# Altium schematic sheet SD_Card.SchDoc: Audio Research: SD Card
size A4; DrawnBy: Connor Dack; Engineer: Connor Dack; DocumentNumber: 9; Revision: 1.0; SheetNumber: 9; SheetTotal: 20
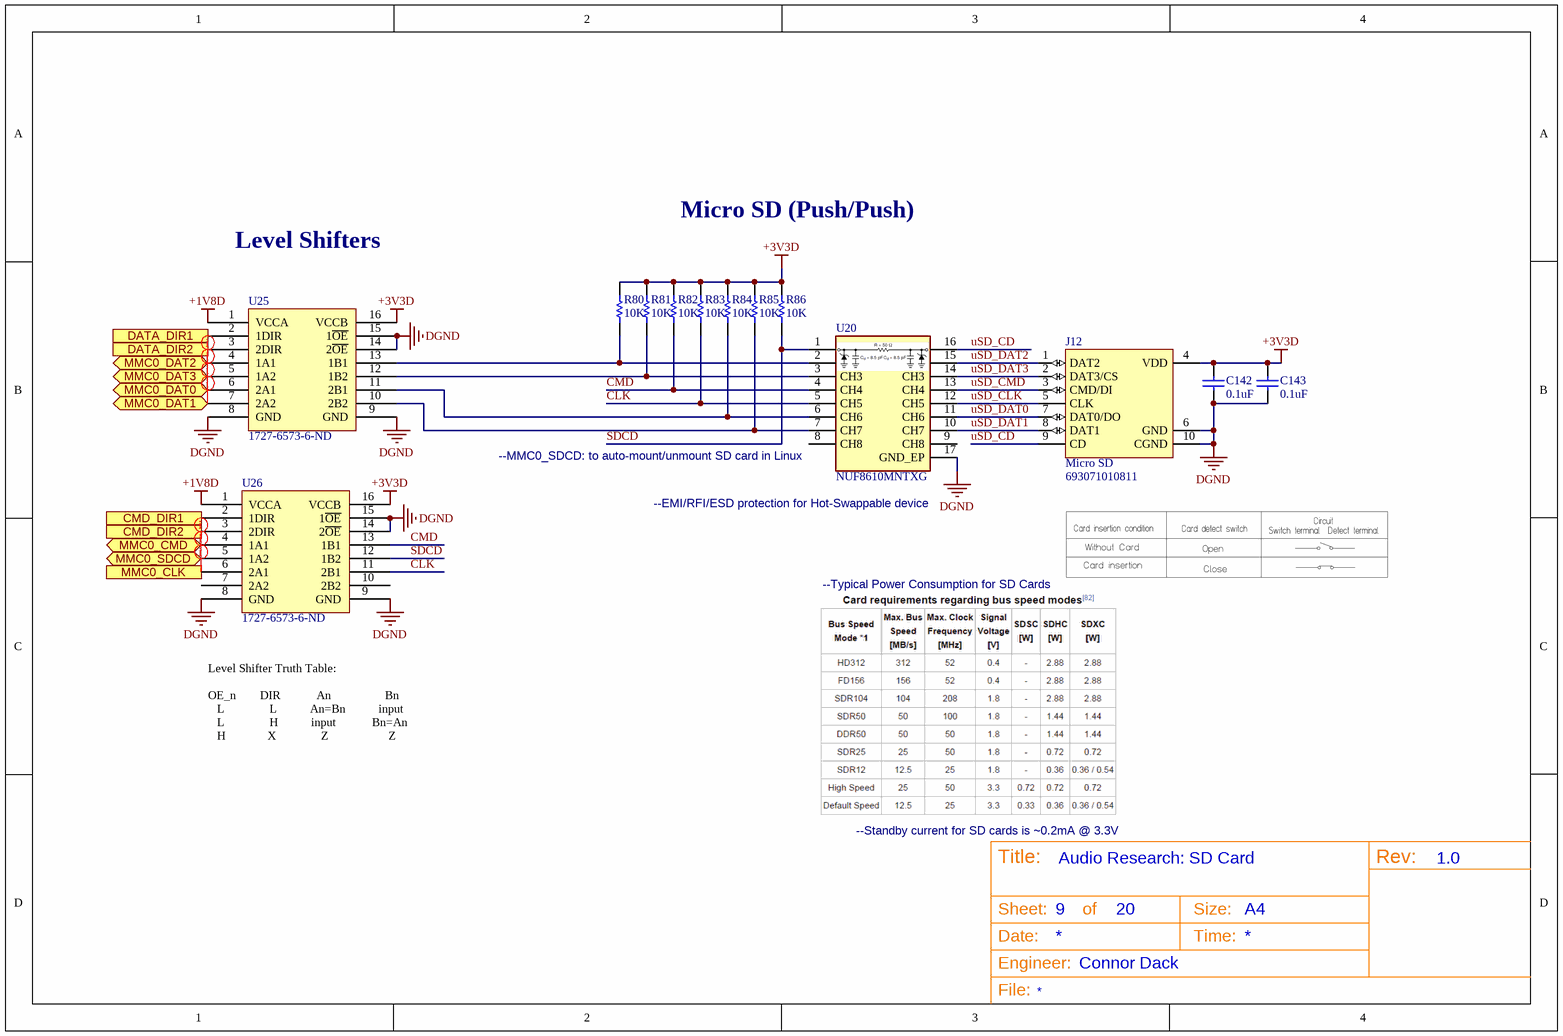
[diagram p0: SD_Card.SchDoc]

## Parts
C142  Capacitance: 0.1uF  [3-0603_L]  (hidden comment: CL10F104ZO8NNNC)
C143  Capacitance: 0.1uF  [3-0603_L]  (hidden comment: CL10F104ZO8NNNC)
J12  Micro SD  [693071010811]
R80  Resistance (Ohms): 10K  [2-0402_R_L]  (hidden comment: ERJ-2GEJ103X)
R81  Resistance (Ohms): 10K  [2-0402_R_L]  (hidden comment: ERJ-2GEJ103X)
R82  Resistance (Ohms): 10K  [2-0402_R_L]  (hidden comment: ERJ-2GEJ103X)
R83  Resistance (Ohms): 10K  [2-0402_R_L]  (hidden comment: ERJ-2GEJ103X)
R84  Resistance (Ohms): 10K  [2-0402_R_L]  (hidden comment: ERJ-2GEJ103X)
R85  Resistance (Ohms): 10K  [2-0402_R_L]  (hidden comment: ERJ-2GEJ103X)
R86  Resistance (Ohms): 10K  [2-0402_R_L]  (hidden comment: ERJ-2GEJ103X)
U20  NUF8610MNTXG  [ONSC-DFN-16-506AC_V]
U25  Supplier Part Number 1: 1727-6573-6-ND  [TSOP65P640X120-16N]  (hidden comment: IC TXRX 4BIT DUAL 3ST 16TSSOP)
U26  Supplier Part Number 1: 1727-6573-6-ND  [TSOP65P640X120-16N]  (hidden comment: IC TXRX 4BIT DUAL 3ST 16TSSOP)

## Ports
CMD_DIR1 (in), CMD_DIR2 (in), DATA_DIR1 (in), DATA_DIR2 (in), MMC0_CLK (in), MMC0_CMD (bidir), MMC0_DAT0 (bidir), MMC0_DAT1 (bidir), MMC0_DAT2 (bidir), MMC0_DAT3 (bidir), MMC0_SDCD (bidir)

## Nets
+1V8D: U25.1(VCCA) U26.1(VCCA)
+3V3D: C142.1 C143.1 J12.4(VDD) R80.2 R81.2 R82.2 R83.2 R84.2 R85.2 R86.2 U25.16(VCCB) U26.16(VCCB)
DGND: C142.2 C143.2 J12.6(GND) J12.10(CGND) U20.17(GND_EP) U25.8(GND) U25.9(GND) U25.14(2~{OE}) U25.15(1~{OE}) U26.8(GND) U26.9(GND) U26.14(2~{OE}) U26.15(1~{OE})
CLK: R83.1 U20.5(CH5) U26.11(2B1)
CMD: R82.1 U20.4(CH4) U26.13(1B1)
CMD_DIR1: U26.2(1DIR) ; port CMD_DIR1
CMD_DIR2: U26.3(2DIR) ; port CMD_DIR2
DATA_DIR1: U25.2(1DIR) ; port DATA_DIR1
DATA_DIR2: U25.3(2DIR) ; port DATA_DIR2
MMC0_CLK: U26.6(2A1) ; port MMC0_CLK
MMC0_CMD: U26.4(1A1) ; port MMC0_CMD
MMC0_DAT0: U25.6(2A1) ; port MMC0_DAT0
MMC0_DAT1: U25.7(2A2) ; port MMC0_DAT1
MMC0_DAT2: U25.4(1A1) ; port MMC0_DAT2
MMC0_DAT3: U25.5(1A2) ; port MMC0_DAT3
MMC0_SDCD: U26.5(1A2) ; port MMC0_SDCD
SDCD: R86.1 U20.1(CH1) U26.12(1B2)
uSD_CD: J12.9(CD) U20.16(CH1)
uSD_CLK: J12.5(CLK) U20.12(CH5)
uSD_CMD: J12.3(CMD/DI) U20.13(CH4)
uSD_DAT0: J12.7(DAT0/DO) U20.11(CH6)
uSD_DAT1: J12.8(DAT1) U20.10(CH7)
uSD_DAT2: J12.1(DAT2) U20.15(CH2)
uSD_DAT3: J12.2(DAT3/CS) U20.14(CH3)
NetR80_1: R80.1 U20.2(CH2) U25.13(1B1)
NetR81_1: R81.1 U20.3(CH3) U25.12(1B2)
NetR84_1: R84.1 U20.6(CH6) U25.11(2B1)
NetR85_1: R85.1 U20.7(CH7) U25.10(2B2)

Not connected (* = marked no-connect by the designer): U20 8(CH8) 9(CH8); U26 7(2A2) 10(2B2)

## Layout directives
net class SD_CARD: MMC0_CLK, MMC0_CMD, MMC0_DAT0, MMC0_DAT1, MMC0_DAT2, MMC0_DAT3, MMC0_SDCD

## Notes on the sheet
- Level Shifters
- Micro SD (Push/Push)
- (near U20) --MMC0_SDCD: to auto-mount/unmount SD card in Linux
- (near U20) --EMI/RFI/ESD protection for Hot-Swappable device
- --Typical Power Consumption for SD Cards
- Level Shifter Truth Table:
  OE_n        DIR            An                  Bn
  L               L           An=Bn           input
  L               H           input            Bn=An
  H              X               Z                    Z
- --Standby current for SD cards is ~0.2mA @ 3.3V
- Title:
- Sheet:
- of
- Size:
- A4
- Rev:
- Date:
- Engineer:
- Time:
- File:

## Library data of the parts
C142 C143 = CL10F104ZO8NNNC: CAP CER 0.1UF 16V Y5V 0603; Manufacturer: Samsung; Tolerance: 80%; Supplier 1: Digi-Key; Stock 1: 40000; Pricing 1: 1=0.1, 10=0.038, 100=0.0169, 500=0.01208, 1000=0.00949 (USD); Mount: Surface Mount; Case/Package: 0603; Case Code (Metric): 1608; Case Code (Imperial): 0603; Min Operating Temperature: -30°C; Max Operating Temperature: 85°C; Package Quantity: 1; Packaging: Tape and Reel; Voltage Rating: 16V; Dielectric: Y5V; Length: 1.6mm; Height: 0.8mm; Width: 0.031inch; Thickness: 0.035inch; Depth: 0.8mm; Radiation Hardening: No; ComponentLink1URL: https://datasheet.ciiva.com/25805/cl10f104zo8nnnc-25805810.pdf; ComponentLink1Description: https://datasheet.ciiva.com/25805/cl10f104zo8nnnc-25805810.pdf; ComponentLink2URL: https://datasheet.ciiva.com/16199/cl10f104zo8nnnc-16199254.pdf; ComponentLink2Description: https://datasheet.ciiva.com/16199/cl10f104zo8nnnc-16199254.pdf; Supplier Part Number 1: 1276-1258-6-ND; Manufacturer Part Number: CL10F104ZO8NNNC
J12 = 693071010811_mmc: CONN MICRO SD 8 POS SMD; Manufacturer: Wurth Electronics Inc; Number of Positions: 9 (8 + 1); Connector Type: Connector and Ejector; Insertion, Removal Method: Push In, Push Out; Card Type: Secure Digital - microSD; Supplier 1: Digi-Key; RoHS: RoHS Compliant; Category: Connectors, Interconnects; Stock 1: 6758; Pricing 1: 1=3.32, 10=3.188, 50=2.805, 100=2.6775, 500=2.295, 1400=2.10375 (USD); Packaging: Cut Tape (CT); Ejector Side: -; Mounting Type: Surface Mount, Right Angle; Features: Switch; Height Above Board: 0.072" (1.83mm); Mounting Feature: Normal, Standard - Top; Contact Finish: Gold; Contact Finish Thickness: -; ComponentLink1URL: http://katalog.we-online.de/em/datasheet/693071010811.pdf; ComponentLink1Description: http://katalog.we-online.de/em/datasheet/693071010811.pdf; Supplier Part Number 1: 732-3819-1-ND; Manufacturer Part Number: 693071010811
R80-R86 = ERJ-2GEJ103X: RES 10K OHM 1/10W 5% 0402 SMD; Manufacturer: Panasonic - ECG; Power (Watts): 0.1W, 1/10W; Temperature Coefficient: ±200ppm/°C; Supplier 1: Digi-Key; Manufacturer Part Number: ERJ-2GEJ103X; RoHS: RoHS Compliant; Category: Resistors; Stock 1: 2765902; Pricing 1: 1=0.05, 50=0.0172, 100=0.0131, 250=0.00976, 500=0.0072, 1000=0.0048, 5000=0.00338 (USD); Composition: Thick Film; Features: -; Tolerance: ±5%; Package / Case: 0402 (1005 Metric); Size / Dimension: 0.039" L x 0.020" W (1.00mm x 0.50mm); Height: 0.016" (0.40mm); Number of Terminations: 2; Packaging: Cut Tape (CT); ComponentLink1URL: http://industrial.panasonic.com/www-cgi/jvcr13pz.cgi?E+PZ+3+AOA0001+ERJ2GEJ103X+7+WW; ComponentLink1Description: http://industrial.panasonic.com/www-cgi/jvcr13pz.cgi?E+PZ+3+AOA0001+ERJ2GEJ103X+7+WW; Supplier Part Number 1: P10KJCT-ND
U20 = NUF8610MNTXG: IC EMI FILTER 8CH 16-DFN; Manufacturer: ON Semiconductor; Number of Channels: 8; Attenuation Value: 15dB; ESD Protection: Yes; Capacitance: 8.5pF; Operating Supply Voltage: 5V; Number of Elements: 16; DC Resistance (DCR): 58R; Supplier 1: Digi-Key; Stock 1: 3186; Pricing 1: 1=0.47, 10=0.441, 25=0.4204, 50=0.4068, 100=0.3933, 250=0.373, 500=0.31194, 1000=0.2421 (USD); Packaging: Tape and Reel; Height: 0.039inch; ComponentLink1URL: https://datasheet.ciiva.com/1022/nuf8610-d-1022805.pdf; ComponentLink1Description: https://datasheet.ciiva.com/1022/nuf8610-d-1022805.pdf; Supplier Part Number 1: NUF8610MNTXGOSCT-ND; Manufacturer Part Number: NUF8610MNTXG; Case/Package: DFN; Number of Pins: 16; Contact Plating: Tin,Matte; Min Operating Temperature: -40°C; Max Operating Temperature: 85°C; Package Quantity: 4000; Termination: Flat; Length: 4mm; Width: 0.063inch; Depth: 1.6mm; Radiation Hardening: No; REACH SVHC: No SVHC; Lead Free: Lead Free; ComponentLink2URL: https://datasheet.ciiva.com/1022/nuf8610-d-1022806.pdf; ComponentLink2Description: https://datasheet.ciiva.com/1022/nuf8610-d-1022806.pdf; ComponentLink3URL: https://datasheet.ciiva.com/1022/nuf8610-d-1022807.pdf; ComponentLink3Description: https://datasheet.ciiva.com/1022/nuf8610-d-1022807.pdf; ComponentLink4URL: https://datasheet.ciiva.com/26019/nuf8610-d-26019159.pdf; ComponentLink4Description: https://datasheet.ciiva.com/26019/nuf8610-d-26019159.pdf; ComponentLink5URL: https://datasheet.ciiva.com/12395/nuf8610-d-116660-12395000.pdf; ComponentLink5Description: https://datasheet.ciiva.com/12395/nuf8610-d-116660-12395000.pdf; Voltage Rating (DC): 5V; Circuit Type: Filter; Number of Lines: 8; Halogen Free: Halogen Free
U25 U26 = 74AVC4T245PW,118: Voltage Level Translator Bidirectional 2 Circuit 2 Channel 380Mbps 16-TSSOP; Manufacturer: NXP Semiconductors; Max Supply Voltage: 3.6V; Min Supply Voltage: 800mV; Propagation Delay: 14.7ns; Number of Channels: 4; Number of Elements: 2; Logic Function: Transceiver,Translator; Low Level Output Current: 12mA; Turn-On Delay Time: 14.5ns; Polarity: Non-Inverting; High Level Output Current: -12mA; Quiescent Current: 70uA; Supplier 1: Digi-Key; Stock 1: 22627; Pricing 1: 1=0.9, 10=0.804, 100=0.6266, 500=0.51764, 1000=0.40866 (USD); Mount: Surface Mount; Case/Package: TSSOP; Number of Pins: 16; Contact Plating: Gold; Min Operating Temperature: -40°C; Max Operating Temperature: 125°C; Packaging: Tape and Reel; Package Quantity: 2500; Data Rate: 380Mbps; Number of Bits: 4; Number of Circuits: 2; Radiation Hardening: No; Lead Free: Lead Free; ComponentLink1URL: https://datasheet.ciiva.com/1900/74avc4t245-1900214.pdf; ComponentLink1Description: https://datasheet.ciiva.com/1900/74avc4t245-1900214.pdf; ComponentLink2URL: https://datasheet.ciiva.com/1900/74avc4t245-1900215.pdf; ComponentLink2Description: https://datasheet.ciiva.com/1900/74avc4t245-1900215.pdf; ComponentLink3URL: https://datasheet.ciiva.com/1900/74avc4t245-1900216.pdf; ComponentLink3Description: https://datasheet.ciiva.com/1900/74avc4t245-1900216.pdf; ComponentLink4URL: https://datasheet.ciiva.com/15086/getdatasheetpartid-442686-15086830.pdf; ComponentLink4Description: https://datasheet.ciiva.com/15086/getdatasheetpartid-442686-15086830.pdf; Manufacturer Part Number: 74AVC4T245PW,118